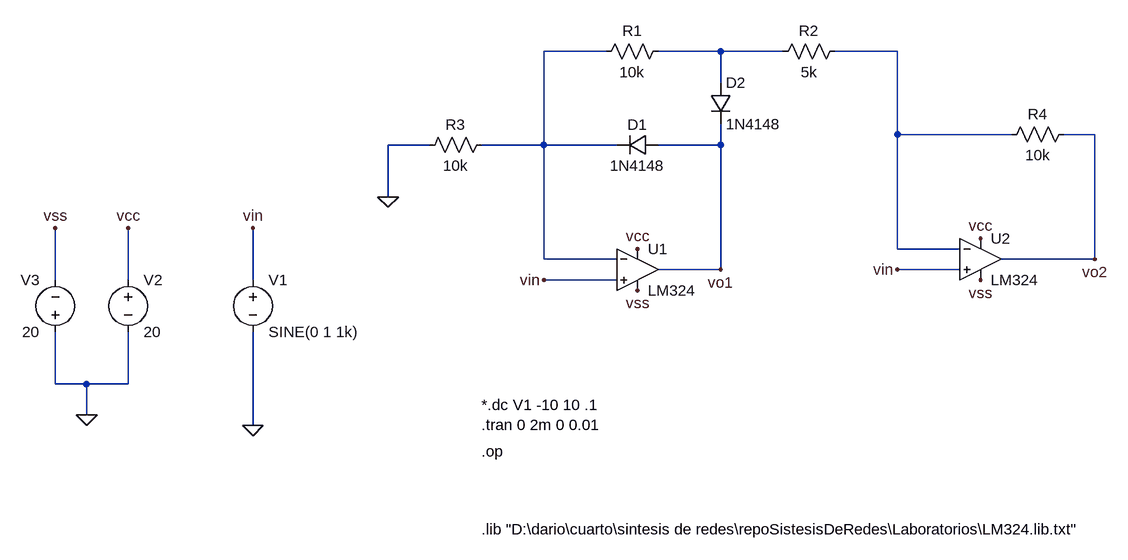
[diagram p0: schematic retificador_De_Presicion.asc]
retificador_De_Presicion.asc, the LTspice schematic file:
Version 4
SHEET 1 1124 680
WIRE 96 -288 0 -288
WIRE 272 -288 176 -288
WIRE 368 -288 272 -288
WIRE 544 -288 448 -288
WIRE 272 -240 272 -288
WIRE 544 -160 544 -288
WIRE 720 -160 544 -160
WIRE 848 -160 800 -160
WIRE -176 -144 -240 -144
WIRE 0 -144 0 -288
WIRE 0 -144 -96 -144
WIRE 112 -144 0 -144
WIRE 272 -144 272 -176
WIRE 272 -144 176 -144
WIRE -240 -64 -240 -144
WIRE 544 16 544 -160
WIRE 640 16 544 16
WIRE 0 32 0 -144
WIRE 112 32 0 32
WIRE 848 32 848 -160
WIRE 848 32 704 32
WIRE 272 48 272 -144
WIRE 272 48 176 48
WIRE 640 48 544 48
WIRE -752 64 -752 -16
WIRE -640 64 -640 -16
WIRE -448 64 -448 -16
WIRE 112 64 0 64
WIRE -752 224 -752 144
WIRE -704 224 -752 224
WIRE -640 224 -640 144
WIRE -640 224 -704 224
WIRE -704 272 -704 224
WIRE -448 288 -448 144
FLAG -240 -64 0
FLAG -704 272 0
FLAG -752 -16 vss
FLAG -640 -16 vcc
FLAG 0 64 vin
FLAG 544 48 vin
FLAG 144 80 vss
FLAG 672 64 vss
FLAG 144 16 vcc
FLAG 672 0 vcc
FLAG -448 288 0
FLAG -448 -16 vin
FLAG 272 48 vo1
FLAG 848 32 vo2
SYMBOL Opamps\\opamp2 144 -16 R0
SYMATTR InstName U1
SYMATTR Value LM324
SYMBOL diode 176 -160 R90
WINDOW 0 0 32 VBottom 2
WINDOW 3 32 32 VTop 2
SYMATTR InstName D1
SYMATTR Value 1N4148
SYMBOL diode 256 -240 R0
SYMATTR InstName D2
SYMATTR Value 1N4148
SYMBOL res -80 -160 R90
WINDOW 0 0 56 VBottom 2
WINDOW 3 32 56 VTop 2
SYMATTR InstName R3
SYMATTR Value 10k
SYMBOL res 192 -304 R90
WINDOW 0 0 56 VBottom 2
WINDOW 3 32 56 VTop 2
SYMATTR InstName R1
SYMATTR Value 10k
SYMBOL res 464 -304 R90
WINDOW 0 0 56 VBottom 2
WINDOW 3 32 56 VTop 2
SYMATTR InstName R2
SYMATTR Value 5k
SYMBOL res 816 -176 R90
WINDOW 0 0 56 VBottom 2
WINDOW 3 32 56 VTop 2
SYMATTR InstName R4
SYMATTR Value 10k
SYMBOL Opamps\\opamp2 672 -32 R0
SYMATTR InstName U2
SYMATTR Value LM324
SYMBOL voltage -448 48 R0
WINDOW 123 0 0 Left 0
WINDOW 39 0 0 Left 0
SYMATTR InstName V1
SYMATTR Value SINE(0 1 1k)
SYMBOL voltage -640 48 R0
WINDOW 123 0 0 Left 0
WINDOW 39 0 0 Left 0
SYMATTR InstName V2
SYMATTR Value 20
SYMBOL voltage -752 160 R180
WINDOW 0 24 96 Left 2
WINDOW 3 24 16 Left 2
WINDOW 123 0 0 Left 0
WINDOW 39 0 0 Left 0
SYMATTR InstName V3
SYMATTR Value 20
TEXT -96 448 Left 2 !.lib "D:\\dario\\cuarto\\sintesis de redes\\repoSistesisDeRedes\\Laboratorios\\LM324.lib.txt"
TEXT -96 256 Left 2 !*.dc V1 -10 10 .1\n.tran 0 2m 0 0.01
TEXT -96 328 Left 2 !.op

The netlist it stands for:
* retificador_De_Presicion.asc
XU1 vin N001 vcc vss vo1 LM324  ; pins In+ In- V+ V- OUT
D1 vo1 N001 1N4148
D2 N002 vo1 1N4148
R3 N001 0 10k
R1 N002 N001 10k
R2 N003 N002 5k
R4 vo2 N003 10k
XU2 vin N003 vcc vss vo2 LM324  ; pins In+ In- V+ V- OUT
V1 vin 0 SINE(0 1 1k)
V2 vcc 0 20
V3 0 vss 20
.model D D
.lib standard.dio
.lib "D:\dario\cuarto\sintesis de redes\repoSistesisDeRedes\Laboratorios\LM324.lib.txt"
*.dc V1 -10 10 .1
.tran 0 2m 0 0.01
.op
.backanno
.end